# Altium schematic sheet 780-00012-P3, rev3 Sch M2 Focus Drive.SchDoc
size B; SheetNumber: 3; SheetTotal: 4; PageSetup: Record=PageOptions|CenterHorizontal=True|CenterVertical=True|PrintScale=1.09|XCorrection=1.00|YCorrection=1.00|PrintKind=0|BorderSize=5000000|LeftOffset=0|BottomOffset=0|Orientation=2|PaperLength=1000|PaperWidth=1000|Scale=100|PaperSource=7|PrintQuality=-4|MediaType=1|DitherType=10|PaperKind=Tabloid 11 x 17in|PrintScaleMode=1
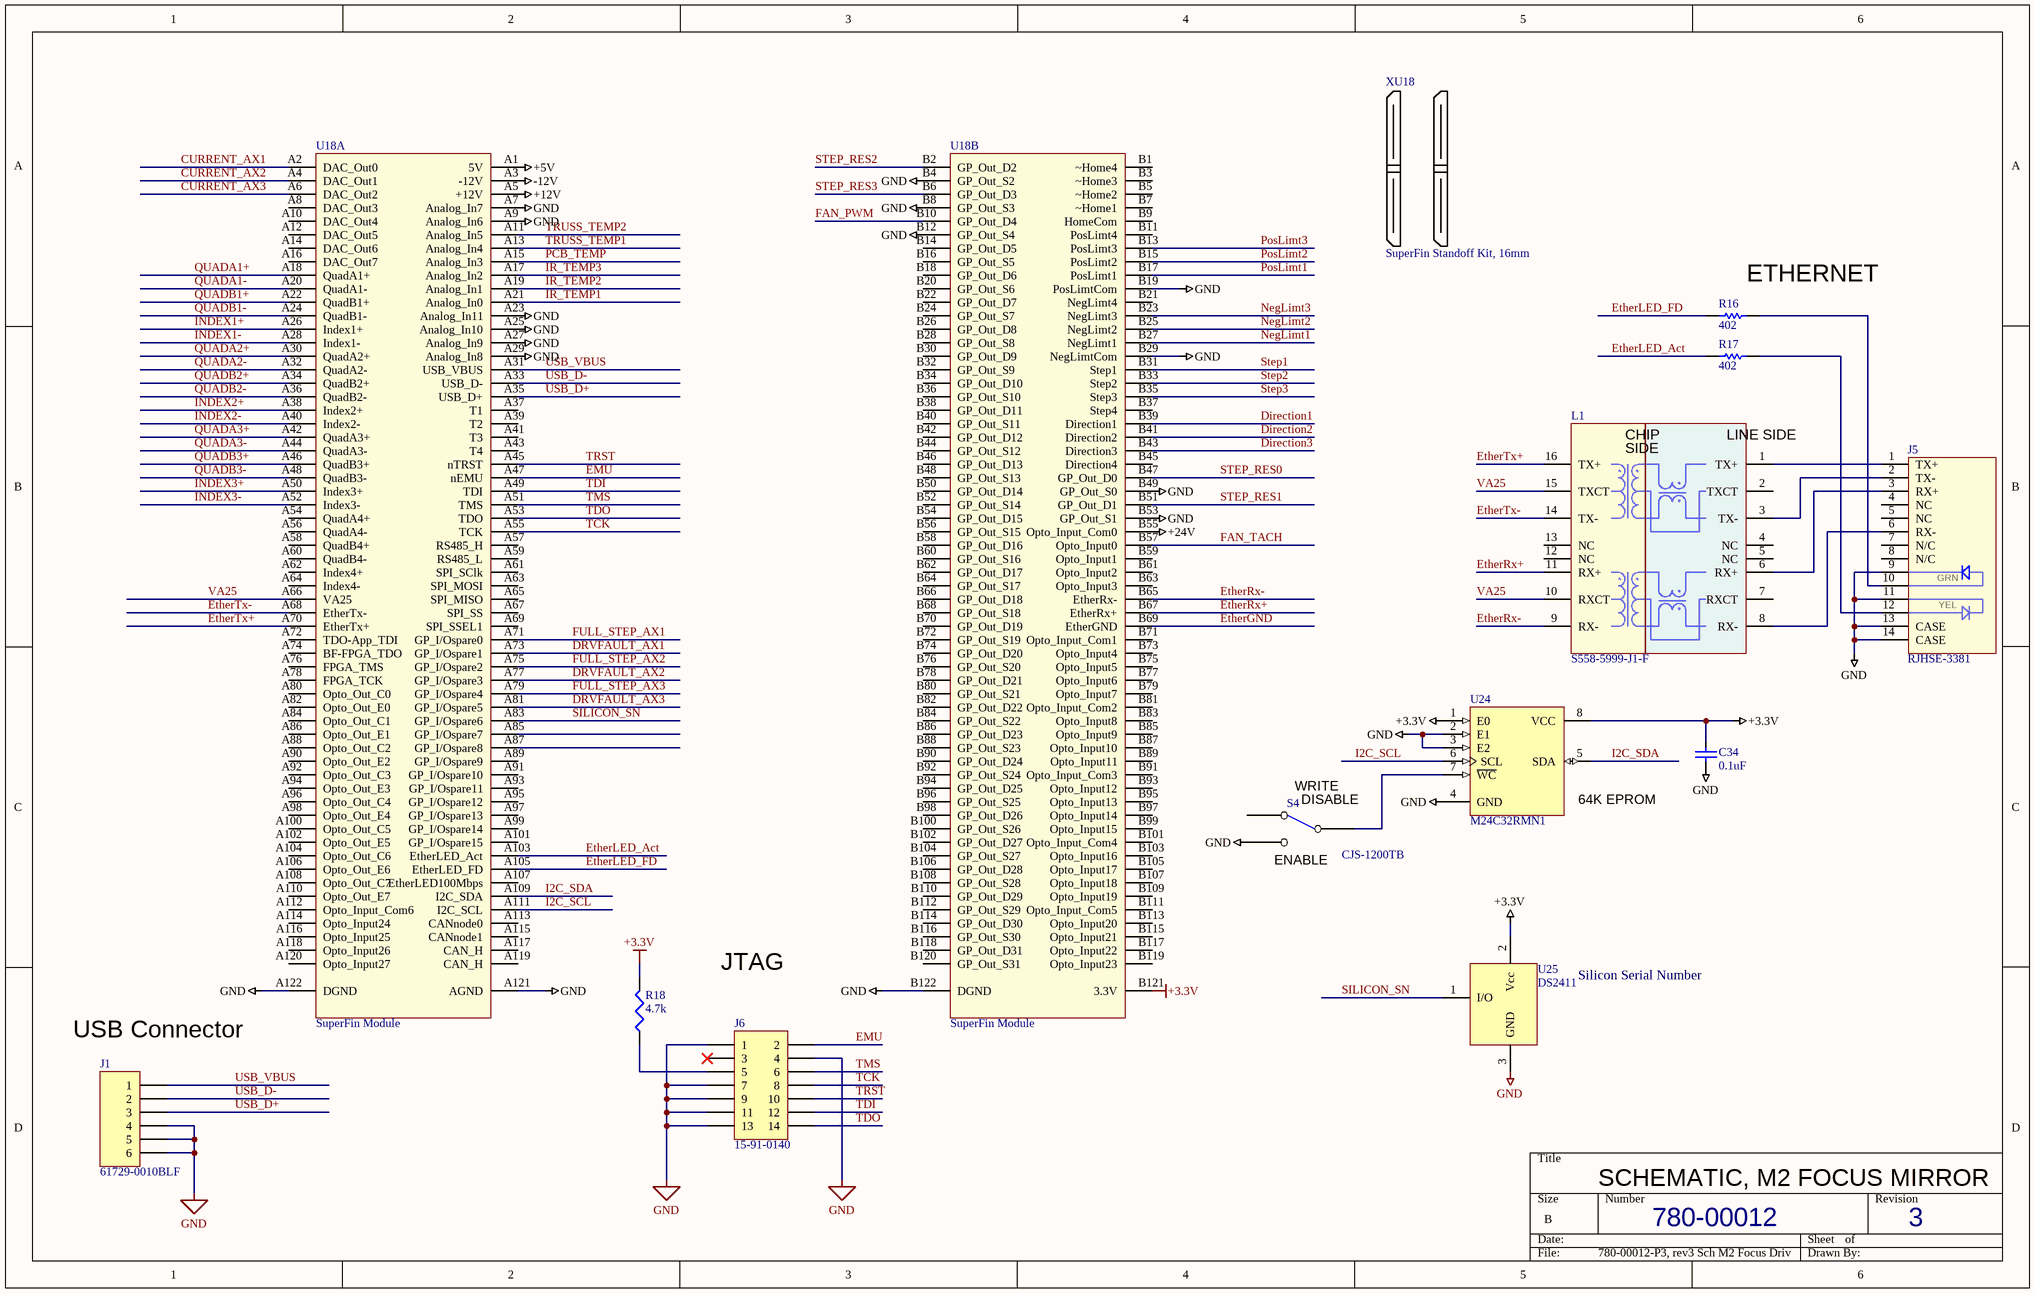
[diagram p0: 780-00012-P3, rev3 Sch M2 Focus Drive.SchDoc]

## Parts
C34  value 0.1uF  [SMD_0805]  (hidden comment: Cap SMD)
J1  61729-0010BLF  [USB Vertical PCB]
J5  RJHSE-3381  [RJ45, VERT MOUNT, NO MAGNETICS]
J6  15-91-0140  [HDR2X7]
L1  S558-5999-J1-F  [10/100BT Magetics module]
R16  value 402  [SMD_0805]  (hidden comment: Res 0805)
R17  value 402  [SMD_0805]  (hidden comment: Res 0805)
R18  4.7k  [2012[0805]]
S4  CJS-1200TB  [CAS-120B]
U18  SuperFin Module  [SuperFin Footprint]  (parts A,B of 2)
U24  M24C32RMN1  [SOP8_N]
U25  DS2411  [SMD_SOT23_3]
XU18  SuperFin Standoff Kit, 16mm  (mechanical)

## Nets
+3.3V: C34.2 R18.2 U18.B121(3.3V) U24.1(E0) U24.8(VCC) U25.2(Vcc)
+5V: U18.A1(5V)
+12V: U18.A5(+12V)
+24V: U18.B55(Opto_Input_Com0)
-12V: U18.A3(-12V)
GND: C34.1 J1.4 J1.5 J1.6 J5.9(GRN-Anode) J5.11(YEL-Cathode) J5.13(CASE) J5.14(CASE) J6.1 J6.4 J6.7 J6.9 J6.11 J6.13 S4.1(NO) U18.A7(Analog_In7) U18.A9(Analog_In6) U18.A23(Analog_In11) U18.A25(Analog_In10) U18.A27(Analog_In9) U18.A29(Analog_In8) U18.A121(AGND) U18.A122(DGND) U18.B4(GP_Out_S2) U18.B8(GP_Out_S3) U18.B12(GP_Out_S4) U18.B19(PosLimtCom) U18.B29(NegLimtCom) U18.B49(GP_Out_S0) U18.B53(GP_Out_S1) U18.B122(DGND) U24.2(E1) U24.3(E2) U24.4(GND) U25.3(GND)
CURRENT_AX1: U18.A2(DAC_Out0)
CURRENT_AX2: U18.A4(DAC_Out1)
CURRENT_AX3: U18.A6(DAC_Out2)
Direction1: U18.B39(Direction1)
Direction2: U18.B41(Direction2)
Direction3: U18.B43(Direction3)
DRVFAULT_AX1: U18.A73(GP_I/Ospare1)
DRVFAULT_AX2: U18.A77(GP_I/Ospare3)
DRVFAULT_AX3: U18.A81(GP_I/Ospare5)
EMU: J6.2 U18.A47(nEMU)
EtherGND: U18.B69(EtherGND)
EtherLED_Act: R17.1 U18.A103(EtherLED_Act)
EtherLED_FD: R16.1 U18.A105(EtherLED_FD)
EtherRx+: L1.11(RX+) U18.B67(EtherRx+)
EtherRx-: L1.9(RX-) U18.B65(EtherRx-)
EtherTx+: L1.16(TX+) U18.A70(EtherTx+)
EtherTx-: L1.14(TX-) U18.A68(EtherTx-)
FAN_PWM: U18.B10(GP_Out_D4)
FAN_TACH: U18.B57(Opto_Input0)
FULL_STEP_AX1: U18.A71(GP_I/Ospare0)
FULL_STEP_AX2: U18.A75(GP_I/Ospare2)
FULL_STEP_AX3: U18.A79(GP_I/Ospare4)
I2C_SCL: U18.A111(I2C_SCL) U24.6(SCL)
I2C_SDA: U18.A109(I2C_SDA) U24.5(SDA)
INDEX1+: U18.A26(Index1+)
INDEX1-: U18.A28(Index1-)
INDEX2+: U18.A38(Index2+)
INDEX2-: U18.A40(Index2-)
INDEX3+: U18.A50(Index3+)
INDEX3-: U18.A52(Index3-)
IR_TEMP1: U18.A21(Analog_In0)
IR_TEMP2: U18.A19(Analog_In1)
IR_TEMP3: U18.A17(Analog_In2)
NegLimt1: U18.B27(NegLimt1)
NegLimt2: U18.B25(NegLimt2)
NegLimt3: U18.B23(NegLimt3)
PCB_TEMP: U18.A15(Analog_In3)
PosLimt1: U18.B17(PosLimt1)
PosLimt2: U18.B15(PosLimt2)
PosLimt3: U18.B13(PosLimt3)
QUADA1+: U18.A18(QuadA1+)
QUADA1-: U18.A20(QuadA1-)
QUADA2+: U18.A30(QuadA2+)
QUADA2-: U18.A32(QuadA2-)
QUADA3+: U18.A42(QuadA3+)
QUADA3-: U18.A44(QuadA3-)
QUADB1+: U18.A22(QuadB1+)
QUADB1-: U18.A24(QuadB1-)
QUADB2+: U18.A34(QuadB2+)
QUADB2-: U18.A36(QuadB2-)
QUADB3+: U18.A46(QuadB3+)
QUADB3-: U18.A48(QuadB3-)
SILICON_SN: U18.A83(GP_I/Ospare6) U25.1(I/O)
Step1: U18.B31(Step1)
Step2: U18.B33(Step2)
Step3: U18.B35(Step3)
STEP_RES0: U18.B47(GP_Out_D0)
STEP_RES1: U18.B51(GP_Out_D1)
STEP_RES2: U18.B2(GP_Out_D2)
STEP_RES3: U18.B6(GP_Out_D3)
TCK: J6.8 U18.A55(TCK)
TDI: J6.12 U18.A49(TDI)
TDO: J6.14 U18.A53(TDO)
TMS: J6.6 U18.A51(TMS)
TRST: J6.10 U18.A45(nTRST)
TRUSS_TEMP1: U18.A13(Analog_In4)
TRUSS_TEMP2: U18.A11(Analog_In5)
USB_D+: J1.3 U18.A35(USB_D+)
USB_D-: J1.2 U18.A33(USB_D-)
USB_VBUS: J1.1 U18.A31(USB_VBUS)
VA25: L1.10(RXCT) L1.15(TXCT) U18.A66(VA25)
NetJ5_1: J5.1(TX+) L1.1(TX+)
NetJ5_2: J5.2(TX-) L1.3(TX-)
NetJ5_3: J5.3(RX+) L1.6(RX+)
NetJ5_6: J5.6(RX-) L1.8(RX-)
NetJ5_10: J5.10(GRN-Cathode) R16.2
NetJ5_12: J5.12(YEL-Anode) R17.2
NetJ6_5: J6.5 R18.1
NetS4_2: S4.2(COM) U24.7(~{WC})

Not connected (* = marked no-connect by the designer): J5 4(NC) 5(NC) 7(N/C) 8(N/C); J6 3*; L1 2(TXCT) 4(NC) 5(NC) 7(RXCT) 12(NC) 13(NC); S4 3(NC); U18 A8(DAC_Out3) A10(DAC_Out4) A12(DAC_Out5) A14(DAC_Out6) A16(DAC_Out7) A37(T1) A39(T2) A41(T3) A43(T4) A54(QuadA4+) A56(QuadA4-) A57(RS485_H) A58(QuadB4+) A59(RS485_L) A60(QuadB4-) A61(SPI_SClk) A62(Index4+) A63(SPI_MOSI) A64(Index4-) A65(SPI_MISO) A67(SPI_SS) A69(SPI_SSEL1) A72(TDO-App_TDI) A74(BF-FPGA_TDO) A76(FPGA_TMS) A78(FPGA_TCK) A80(Opto_Out_C0) A82(Opto_Out_E0) A84(Opto_Out_C1) A85(GP_I/Ospare7) A86(Opto_Out_E1) A87(GP_I/Ospare8) A88(Opto_Out_C2) A89(GP_I/Ospare9) A90(Opto_Out_E2) A91(GP_I/Ospare10) A92(Opto_Out_C3) A93(GP_I/Ospare11) A94(Opto_Out_E3) A95(GP_I/Ospare12) A96(Opto_Out_C4) A97(GP_I/Ospare13) A98(Opto_Out_E4) A99(GP_I/Ospare14) A100(Opto_Out_C5) A101(GP_I/Ospare15) A102(Opto_Out_E5) A104(Opto_Out_C6) A106(Opto_Out_E6) A107(EtherLED100Mbps) A108(Opto_Out_C7) A110(Opto_Out_E7) A112(Opto_Input_Com6) A113(CANnode0) A114(Opto_Input24) A115(CANnode1) A116(Opto_Input25) A117(CAN_H) A118(Opto_Input26) A119(CAN_H) A120(Opto_Input27) B1(~Home4) B3(~Home3) B5(~Home2) B7(~Home1) B9(HomeCom) B11(PosLimt4) B14(GP_Out_D5) B16(GP_Out_S5) B18(GP_Out_D6) B20(GP_Out_S6) B21(NegLimt4) B22(GP_Out_D7) B24(GP_Out_S7) B26(GP_Out_D8) B28(GP_Out_S8) B30(GP_Out_D9) B32(GP_Out_S9) B34(GP_Out_D10) B36(GP_Out_S10) B37(Step4) B38(GP_Out_D11) B40(GP_Out_S11) B42(GP_Out_D12) B44(GP_Out_S12) B45(Direction4) B46(GP_Out_D13) B48(GP_Out_S13) B50(GP_Out_D14) B52(GP_Out_S14) B54(GP_Out_D15) B56(GP_Out_S15) B58(GP_Out_D16) B59(Opto_Input1) B60(GP_Out_S16) B61(Opto_Input2) B62(GP_Out_D17) B63(Opto_Input3) B64(GP_Out_S17) B66(GP_Out_D18) B68(GP_Out_S18) B70(GP_Out_D19) B71(Opto_Input_Com1) B72(GP_Out_S19) B73(Opto_Input4) B74(GP_Out_D20) B75(Opto_Input5) B76(GP_Out_S20) B77(Opto_Input6) B78(GP_Out_D21) B79(Opto_Input7) B80(GP_Out_S21) B81(Opto_Input_Com2) B82(GP_Out_D22) B83(Opto_Input8) B84(GP_Out_S22) B85(Opto_Input9) B86(GP_Out_D23) B87(Opto_Input10) B88(GP_Out_S23) B89(Opto_Input11) B90(GP_Out_D24) B91(Opto_Input_Com3) B92(GP_Out_S24) B93(Opto_Input12) B94(GP_Out_D25) B95(Opto_Input13) B96(GP_Out_S25) B97(Opto_Input14) B98(GP_Out_D26) B99(Opto_Input15) B100(GP_Out_S26) B101(Opto_Input_Com4) B102(GP_Out_D27) B103(Opto_Input16) B104(GP_Out_S27) B105(Opto_Input17) B106(GP_Out_D28) B107(Opto_Input18) B108(GP_Out_S28) B109(Opto_Input19) B110(GP_Out_D29) B111(Opto_Input_Com5) B112(GP_Out_S29) B113(Opto_Input20) B114(GP_Out_D30) B115(Opto_Input21) B116(GP_Out_S30) B117(Opto_Input22) B118(GP_Out_D31) B119(Opto_Input23) B120(GP_Out_S31)

## Notes on the sheet
- (near R16) ETHERNET
- (near S4) WRITE
- (near S4) DISABLE
- (near U24) 64K EPROM
- (near S4) ENABLE
- JTAG
- (near J1) USB Connector
- Silicon Serial Number
- SCHEMATIC, M2 FOCUS MIRROR
- 780-00012
- 3
- (in symbol CONN RJ-45 w/o magnetics) GRN; YEL
- (in symbol Ethernet Magnetics module) CHIP; LINE SIDE; SIDE

## Library data of the parts
C34 = Cap SMD: Capacitor; Manufacturer: AVX; Manuf p/n: 08055C104KAT2A; Vendor: DigiKey; Vendor p/n: 478-1395-1-ND; Vendor Mult.: 10; LCO P/N: 120-00002; COST: 0.088
J1 = Header 6: Header, 6-Pin; Manufacturer: FCI; Value: USB TYPE B; Vendor: DigiKey; Vendor Mult.: 1; Arena Type: Connector; LCO p/n: 125-00039; COST: 1.12
J5 = CONN RJ-45 w/o magnetics: Vertical PC mount, w/o magnetics; LCO p/n: 125-00040
J6 = Header 7X2: Header, 7-Pin, Dual row; Manufacturer: Molex/Waldom; Vendor: DIGIKEY; Vendor Mult.: 1; LCO p/n: 125-00005; Value: HEADER 7X2
L1 = Ethernet Magnetics module: 10/100BT Magnetics Module; LCO p/n: 155-00014
R16 R17 = Res SMD: Resistor 0805; Manufacturer: Vishay/Dale; Manuf p/n: CRCW0805402FKEA; Vendor: DIGIKEY; Vendor p/n: 541-402CCT-ND; Vendor Mult.: 10; LCO p/n: 181-04020; COST: 0.09
R18 = Res3: Resistor; Manufacturer: Dale/Vishay; Manuf p/n: CRCW08054.75KFKEA; Value: 4.75K; Vendor: DIGIKEY; Vendor Mult.: 10; Vendor p/n: 541-4.75KCCT-ND; LCO p/n: 181-04751; COST: 0.08
S4 = SW_SPDT_DOUG: Manufacturer: Copal Electronics; Manuf p/n: CAS-120TA; Vendor: DIGIKEY; Vendor Mult.: 1; Vendor p/n: CAS120JTR-ND; LCO p/n: 185-00010; COST: 1.27; Value: SW_SPDT
U18 = SuperFin Module: LCO p/n: 820-00010
U24 = M24C32RMN1: 32 Kbit Serial I²C Bus EEPROM; LCO p/n: 150-00076
U25 = DS2411: Silicon Serial Number; Manufacturer: MAXIM; Manuf p/n: DS2411R+T&R; Vendor: DIGIKEY; Vendor p/n: DS2411R+CT-ND; Vendor Mult.: 1; LCO p/n: 150-00031; COST: 1.25; VALUE: DS2411
XU18 = SuperFin Standoff Kit, 16mm: LCO p/n: 810-00006